# Altium schematic sheet Misaka-v1.0.SchDoc (part 2 of 2)
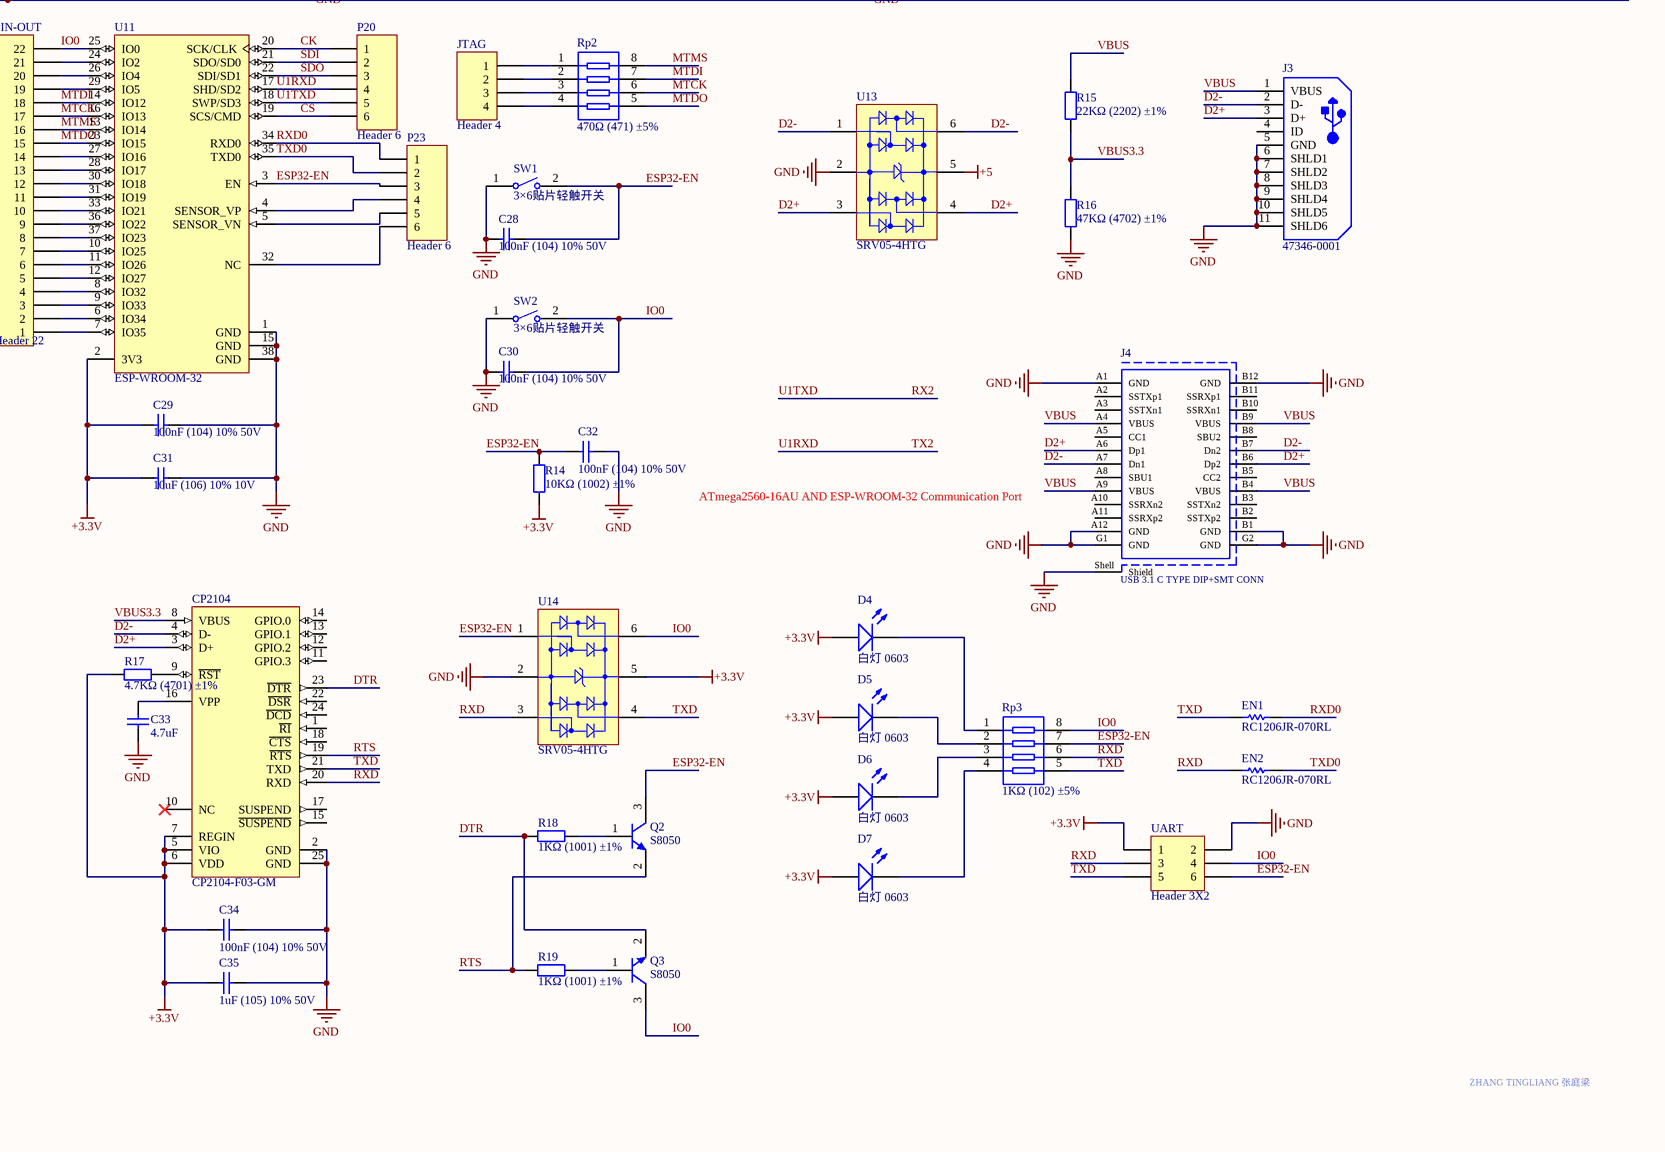
[diagram p4: Misaka-v1.0.SchDoc, bottom right]

## Library data of the parts
C1 C2 C6-C9 C11-C14 C18-C30 C32 C34 C36 C37 C-VCCREG C-VDD C-VREG C-VSREG = 0603 100nF (104) 10% 50V: 贴片电容; ComponentLink1Description: 供应商链接; ComponentLink1URL: http://www.szlcsc.com/product/details_15331.html; Package: 0603; Supplier: LC; SuppliersPartNumber: C14663
C3 C4 = CMP-2000-06216-1: Aluminum Electrolytic Capacitor, 47 uF, +/- 20%, 35 V, 2-Pin SMD (Size Code D), -55 to 105 degC, RoHS, Tape and Reel; Manufacturer: Panasonic; Lifetime@Temperature: 2000Hrs@105°C; Capacitance: 47µF; Type: Can; Rated Voltage: 35V; Ripple Current: 300mA; ESR (Equivalent Series Resistance): 0.26O; Package Reference: FP-V-D; Package Description: 2-Pin Electrolytic Aluminum Capacitor, Body 6.6 x 6.6 mm; Datasheet URL: http://industrial.panasonic.com/cdbs/www-data/pdf/RDE0000/ABA0000C1184.pdf; Series: FP; Operating Temp Range: -55to+105°C; Operating Temp-Max: 105°C; Datasheet Version: 03/2016; Manufacturer URL: http://www.panasonic.com/; Package URL: http://industrial.panasonic.com/cdbs/www-data/pdf/RDE0000/DME0000COL48.pdf; Case Size/Dimension: Ø6.3x5.8mm; Mounting Technology: SurfaceMount
C5 C10 C35 C41 C42 = 0603 1uF (105) 10% 50V: 贴片电容; ComponentLink1Description: 供应商链接; ComponentLink1URL: http://www.szlcsc.com/product/details_16531.html; Package: 0603; Supplier: LC; SuppliersPartNumber: C15849
C15-C17 = 0603 22pF (220) 5% 50V: 贴片电容; ComponentLink1Description: 供应商链接; ComponentLink1URL: http://www.szlcsc.com/product/details_2005.html; Package: 0603; Supplier: LC; SuppliersPartNumber: C1653
C31 C38 C39 = 0603 10uF (106) 10% 10V: 贴片电容; ComponentLink1Description: 供应商链接; ComponentLink1URL: http://www.szlcsc.com/product/details_20411.html; Package: 0603; Supplier: LC; SuppliersPartNumber: C19702
C33 = 0603 4.7uF (475) 10% 16V: 贴片电容; ComponentLink1Description: 供应商链接; ComponentLink1URL: http://www.szlcsc.com/product/details_20375.html; Package: 0603; Supplier: LC; SuppliersPartNumber: C19666
C40 = CMP-2000-06222-1: Aluminum Electrolytic Capacitor, 220 uF, +/- 20%, 63 V, 2-Pin SMD (Size Code H13), -55 to 105 degC, RoHS, Tape and Reel; Manufacturer: Panasonic; Impedance: 0.16ohm; Life Time @ Temperature: 2000hours@105°C; Product Range: PANASONIC-?????FK; Voltage Rating: 63V; External Length / Height: 13.5mm; Ripple Current Temperature: 105°C; Ripple Current Frequency: 100kHz; Ripple Current AC: 800mA; Power Factor: 0.08; Power Factor Frequency: 120Hz; AE Capacitor Case: RadialCan-SMD; Capacitance: 220µF; Operating Lifetime: 2000h; SVHC: NoSVHC(16-Dec-2013); Diameter: 12.5mm; Package Description: 2-Pin Electrolytic Aluminum Capacitor, Body 13.5 x 13.5 mm; Height: 13.5mm; Package URL: http://industrial.panasonic.com/cdbs/www-data/pdf/RDE0000/DME0000COL48.pdf; Lifetime @ Temperature: 2000hours@105°C; Series: FK; Mounting Technology: SurfaceMount; Datasheet Version: 03/2016; Package / Case: H13; Voltage Rating V DC: 63V; Capacitance Tolerance ±: ±20%; Tolerance +: 20%; Capacitance Tolerance: ±20%; Package Reference: FK-V-H13; Datasheet URL: https://industrial.panasonic.com/cdbs/www-data/pdf/RDE0000/ABA0000C1181.pdf; Operating Temperature Range: -55°Cto+105°C; Manufacturer URL: http://www.panasonic.com/; Operating Temperature Min: -55°C; Capacitor Terminals: SMD; Packaging: CutTape; Operating Temperature Max: 105°C; Tolerance -: 20%; Operating life Time: 2000h; Capacitor Case Style: SMD
C-BOOT C-VCC = 0603 470nF (474) 10% 25V: 贴片电容; ComponentLink1Description: 供应商链接; ComponentLink1URL: http://www.szlcsc.com/product/details_1975.html; Package: 0603; Supplier: LC; SuppliersPartNumber: C1623
C-FLY = 0603 47nF (473) 10% 50V: 贴片电容; ComponentLink1Description: 供应商链接; ComponentLink1URL: http://www.szlcsc.com/product/details_1974.html; Package: 0603; Supplier: LC; SuppliersPartNumber: C1622
C-VREGPOL = CMP-2000-06209-1: Cap Aluminum Lytic, 22 uF, +/- 20%, 6.3 to 100 V, -55 to 105 degC, 2-Pin SMD, RoHS, Tape and Reel; Manufacturer: Panasonic; Capacitance: 22µF; Rated Voltage: 50V; Lifetime@Temperature: 2000Hrs@105°C; Ripple Current: 165mA; Impedance: 0.88O; Operating Temp Range: -55to+105°C; Package Reference: EEE-FK1H220P; Case Size/Dimension: Ø6.3x5.8mm; Manufacturer URL: http://www.panasonic.com/; Datasheet URL: http://www.mouser.com/ds/2/315/ABA0000CE120-68386.pdf; Mounting Technology: SurfaceMount; Datasheet Version: 03/2014; Package Description: 2-Pin Aluminum Electrolytic Capacitor, Base 6.6 x 6.6 mm, Height 6.10 mm; Operating Temp-Max: 105°C; Series: FK; Type: Can
C-VS = 0603 220nF (224) 10% 25V: 贴片电容; ComponentLink1Description: 供应商链接; ComponentLink1URL: http://www.szlcsc.com/product/details_21832.html; Package: 0603; Supplier: LC; SuppliersPartNumber: C21120
CalibrationHeader P2 = Header 7: Header, 7-Pin; LatestRevisionDate: 17-Jul-2002; LatestRevisionNote: Re-released for DXP Platform.; Publisher: Altium Limited
Camera = MHDR2X4: Header, 4-Pin, Dual row; LatestRevisionDate: 17-Jul-2002; LatestRevisionNote: Re-released for DXP Platform.; Publisher: Altium Limited
CP2104 = CMP-0511-00004-1: Single-Chip USB to UART Bridge, 4 Dig I/O Pins, Internal Oscillator, 1024 Bytes EEPROM, -40 to 85 degC, 24-pin QFN; Manufacturer: Silicon Labs; Sub-Family: USB Bridges; Internal Oscillator: TRUE; Mounting Technology: Surface Mount; ComponentLink3URL: http://www.silabs.com/Support%20Documents/TechnicalDocs/C8051F93x-92x.pdf; DatasheetVersion: Rev. 1.0; ComponentLink1URL: http://www.silabs.com/; Code_IPC: J-STD-020; ComponentLink2URL: http://www.silabs.com/Support%20Documents/TechnicalDocs/cp2104.pdf; Code_JEDEC: MO-220; PackageReference: QFN-24; ComponentLink3Description: Package Specification; PartNumber: CP2104-F03-GM; ComponentLink1Description: Manufacturer URL; ComponentLink2Description: Datasheet; EEPROM: 1024 Bytes; PackageDescription: 24-Pin Quad-Flat No-Leads Package, Body 4 x 4 mm, Pitch 0.5 mm
D1 D8 D9 = SMA(DO-214AC) M7: 二极管; Notepad: 1N4007 4007 编号C2464 已经停售, 使用新物料编号C95872; ComponentLink1Description: 供应商链接; ComponentLink1URL: http://www.szlcsc.com/product/details_2841.html; Package: SMA(DO-214AC); Supplier: LC; SuppliersPartNumber: C95872
D2 D3 = CMP-0583-00001-2: 75 V Small Signal Switching Diode, 150 mA, 2.5 uA, 1026 Molded Package, RoHS, Tape and Reel; Manufacturer: Bourns; Reverse Voltage: 75 V; Average Forward Current: 150 mA; Reverse Current (Max.): 2.5 uA; Capacitance Between Terminals (Max.): 3 pF; Reverse Recovery Time (Max.): 4 nS; Forward Voltage (Max.): 1.00 V; Packing: Tape and Reel; Mounting Technology: Surface Mount; DatasheetVersion: Rev. 06/11; ComponentLink2URL: http://www.bourns.com/data/global/pdfs/CD1206_S01575.pdf; PackageReference: CD1206-S01575-2; RoHS: TRUE; ComponentLink1URL: http://www.bourns.com/; ComponentLink1Description: Manufacturer URL; ComponentLink3Description: Package Specification; ComponentLink3URL: http://www.bourns.com/data/global/pdfs/CD1206_S01575.pdf; ComponentLink2Description: Datasheet; PackageDescription: 2-Pin SMD, Body 3.2 x 1.5 mm; PartNumber: CD1206-S01575
D4-D7 = 0603 白灯: 发光二极管; ComponentLink1Description: 供应商链接; ComponentLink1URL: http://www.szlcsc.com/product/details_2663.html; Package: 0603; Supplier: LC; SuppliersPartNumber: C2290
EEPROM = CMP-0159-00332-1: 2Kbit, 400kHz, 2.5V, I2C Serial EEPROM, 8-Pin SOIC 150mil, Industrial Temperature; PackageReference: SOIC-SN8; Code_JEDEC: MS-012; DatasheetVersion: revJ, Feb-2009; Code_IPC: SOIC127P600-8; PackageVersion: revBB, Aug-2009; PackageDescription: 8-Lead Plastic Small Outline (SN) - Narrow, 3.90mm Body [SOIC]
EN1 EN2 GROUND-EN1 RESET-EN1 = CMP-2100-03681-1: Chip Resistor, 0 Ohm, +/- 5%, -55 to 155 degC, 1206 (3216 Metric), RoHS, Tape and Reel; Manufacturer: Yageo; Max Power Dissipation: 250mW; Resistance: 0mOhm; Voltage Rating: 200V; Temperature Coefficient: 200ppm/degreesC; Case Code (Imperial): 1206; Lead Free: LeadFree; Package Quantity: 5000; Radiation Hardening: No; Tolerance: 5%; Length: 3.1mm; Termination: SMD/SMT; Contact Plating: Tin; Military Standard: Not; Manufacturer URL: http://www.yageo.com/; Datasheet URL: http://www.yageo.com/documents/recent/PYu-RC_Group_51_RoHS_L_5.pdf; Height: 0.026inch; RoHSCompliant: true; Min Operating Temperature: -55degC; REACH SVHC: Unknown; Max Operating Temperature: 155degC; Depth: 1.6mm; Packaging: TapeandReel; Package Reference: 1206.0; Number of Terminations: 2; Case/Package: 1206; Composition: CarbonFilm; Case Code (Metric): 3216; Datasheet Version: Rev. 5, 10/2016; Power Rating: 250mW; Package Description: 2-Pin Surface Mount Device, Body 3.1 x 1.6 mm; Width: 0.063inch
F1 = CMP-2100-03653-1: PTC Resettable Fuse, 15 V, 500 mA, -40 to 85 degC, 2-Pin SMD, RoHS, Tape and Reel; Manufacturer: Bourns; Voltage Rating (DC): 15V; Max Current Rating: 100A; Power Dissipation: 800mW; Resistance: 150mOhm; Width: 3.41mm; Package Quantity: 2000; Voltage Rating: 15V; RoHSCompliant: true; Contact Plating: Gold; REACH SVHC: NoSVHC; Datasheet URL: http://www.bourns.com/docs/Product-Datasheets/mfmsmf.pdf; Lead Free: LeadFree; Height: 0.85mm; Min Operating Temperature: -40degC; Case Code (Metric): 4532; Number of Terminals: 2; Case Code (Imperial): 1812; Case/Package: 1812; Current Rating: 100A; Length: 4.73mm; Max Operating Temperature: 85degC; Package Reference: MF-MSMF050-2; Radiation Hardening: No; Datasheet Version: Rev. AG, 08/2016; Packaging: TapeandReel; Termination: SMD/SMT; Supply Voltage: 15V; Manufacturer URL: http://www.bourns.com/; Mount: SurfaceMount; Package Description: 2-Pin Surface Mount Device, Body 4.55 x 3.24 mm
FB1 = CMP-0686-00620-2: Chip Ferrite Bead for Power Lines, 30 Ohm, 4000 mA, -55 to 125 degC, 2 x 1.25 x 1.05 mm SMD, Tape and Reel; Manufacturer: Murata; DC Resistance: 0.014 Ohm Max.; Rated Current: 4000 mA; Impedance (at 100 MHz): 30 Ohm Typ.; ComponentLink3Description: Package Specification; Packing: Tape and Reel; ComponentLink3URL: http://www.murata.com/products/catalog/pdf/c31e.pdf; PackageDescription: 2-Pin Chip, Body 2 x 1.25 mm; DatasheetVersion: 08/2013; ComponentLink2Description: Datasheet; ComponentLink1Description: Manufacturer URL; PartNumber: BLM21PG300SN1D; PackageReference: BLM21_H1050-2; Mounting Technology: Surface Mount; ComponentLink1URL: http://www.murata.com/; Operating Temperature Range: -55 to 125 degC; ComponentLink2URL: http://www.murata.com/products/catalog/pdf/c31e.pdf
IC1 = CMP-0244-00311-1: Low-dropout linear regulator 5V -LM1117IMPX-5.0 / Fixed Low Drop Positive Voltage Regulator, 5V, 4-Pin SOT-223, Tape and Reel; PackageReference: SOT-223; PackageVersion: 2010; ComponentLink2URL: http://www.st.com/internet/com/TECHNICAL_RESOURCES/TECHNICAL_LITERATURE/DATASHEET/CD00000544.pdf; ComponentLink1URL: http://www.st.com; ComponentLink2Description: Datasheet; DatasheetVersion: 1/11/2011; ComponentLink1Description: Manufacturer URL; PackageDescription: 4-Pin SOT-223 Package, 6.5 x 3.5 mm Body, 2.3 mm Pitch, 7 mm Lead Span
IC2 = CMP-0095-00210-2: 8-bit AVR Microcontroller, 4.5-5.5V, 16MHz, 256KB Flash, 4KB EEPROM, 8KB SRAM, 86 GPIO pins, 100-pin TQFP, Industrial Grade (-40°C to 85°C), Pb-Free; PackageDescription: 100-Pin Thin Profile Plastic Quad Flat Pack (TQFP), 14 x 14 x 1.0 mm Body, 0.5 mm Pitch; ComponentLink1Description: Manufacturer URL; ComponentLink3URL: http://www.atmel.com/dyn/resources/prod_documents/2549S.pdf; RevisionNote: DatasheetVersion & PackageVersion updated. URLs added.; DatasheetVersion: revN, May-2011; ComponentLink2Description: ATmega640/1280/1281/2560/2561 Datasheet; PackageReference: 100A; PackageVersion: revD, Oct-2010; Code_JEDEC: MS-026-AED; ComponentLink1URL: http://www.atmel.com/; ComponentLink2URL: http://www.atmel.com/dyn/resources/prod_documents/doc2549.pdf; ComponentLink3Description: ATmega640/1280/1281/2560/2561 Summary
IC3 = CMP-0758-00080-2: Single Output Low Noise LDO, 150 mA, Fixed 3.3 V Output, 1.5% Tolerance, 2.2 to 16 V Input, Low IQ, 5-Pin SOT-23 (DBV), -40 to 125 degC, Green (RoHS & no Sb/Br), Tape and Reel; Manufacturer: Texas Instruments; Vdo (Typ) (mV): 280; Accuracy (%): 1.5; Output Options: Fixed Output; Fixed Output Options (V): 3.3; Iout (Max) (A): 0.15; Iq (Typ) (mA): 0.85; ComponentLink3Description: Package Specification; Packing: Tape and Reel; ComponentLink3URL: http://www.ti.com/litv/pdf/mpds018j; Vin (V): 2.2 to 16; Mounting Technology: Surface Mount; ComponentLink1URL: http://www.ti.com/; PartNumber: LP2985-33DBVR; PackageReference: DBV0005A; ComponentLink2URL: http://www.ti.com/lit/ds/symlink/lp2985-50.pdf; RoHS: TRUE; ComponentLink2Description: Datasheet; PackageVersion: 4073253-4/L; Operating Temperature Range (degC): -40 to 125; DatasheetVersion: SLVS522N; ComponentLink1Description: Manufacturer URL; PackageDescription: 5-Pin Plastic Small Outline, Body 2.9 x 1.6 mm, Pitch 0.95 mm
IC4 = CMP-0095-00115-3: 8-bit AVR Microcontroller, 2.7-5.5V, 16KB Flash, 512 Bytes EEPROM, 512 Bytes SRAM, 32-pin VQFN, Industrial Grade (-40°C to 85°C); ComponentLink1Description: Manufacturer URL; RevisionNote: Schematic symbol corrected; ComponentLink3URL: http://www.atmel.com/dyn/resources/prod_documents/7799S.pdf; ComponentLink2URL: http://www.atmel.com/dyn/resources/prod_documents/doc7799.pdf; PackageReference: 32PG; DatasheetVersion: revD, Nov-2010; PartNumber: ATmega16U2-MU; PackageVersion: revA, Oct-2008; Code_JEDEC: MO-220WHHD-2; PackageDescription: 32-Pin Quad Flat No-Lead (QFN) Sawn,  5 x 5 x 1.0 mm Body, Pitch 0.50 mm, 3.60mm Exposed Pad; ComponentLink2Description: ATmega8U2/16U2/32U2 Datasheet; ComponentLink1URL: http://www.atmel.com/; ComponentLink3Description: ATmega8U2/16U2/32U2 Summary
ICSP1 ICSP2 POWER TEST-HEADER TEST-HEADER1 UART = Header 3X2: Header, 3-Pin, Dual row; LatestRevisionDate: 17-Jul-2002; LatestRevisionNote: Re-released for DXP Platform.; Publisher: Altium Limited
J1 J3 = CMP-2000-05246-1: Micro-USB B Receptacle with Flange, -30 to 85 degC, 5-Pin SMD, RoHS, Tape and Reel; Manufacturer: Molex; Number of Contacts: 5; Body Orientation: RightAngle; Maximum Voltage Rating: 30VAC; Pitch: 0.65mm; Maximum Current Rating: 1.8/ContactA; Number of Ports: 1; Gender: RCP; Operating Temperature: -30to85C; Part No: 47346-0001; Color: Black; Termination Method: Solder; Contact Plating: GoldOverPalladiumNickelOverNickel; Dimension: 7.8x5.43x2.94mm; Number of Terminals: 5; Datasheet Version: Dec-13; Datasheet URL: https://datasheet.ciiva.com/30075/304740473460001-io-nectors-30075527.pdf; Contact Material: CopperAlloy; RoHS: Yes; Housing Material: LiquidCrystalPolymer; Manufacturer URL: http://www.molex.com/; Packaging: EmbossedTapeandReel; Mounting: SurfaceMount; Type: MicroUSBTypeB
J2 J4 = CMP-1502-03213-1: USB 3.1 Type C Receptacle WR-COM, Horizontal, SMT / THT; Manufacturer: Wurth Elektronik; Working Voltage: 20VDC; Rated Current: 5A; Contact Resistance: 30mOhm; Operating Temperature: -40to105degC; Publisher: WurthElektronik; Gender: Receptacle; Part Number: 632723100011; Mounting Technology: SMT/THT; Datasheet URL: https://katalog.we-online.de/em/datasheet/632723x00011%282%29.pdf; Connector Type: USB3.1TypeC; Manufacturer URL: https://item.szlcsc.com/292999.html; Orientation: Horizontal; Package Reference: 632723100011; Packaging: TapeandReel
JTAG P7 P12 P13 = Header 4: Header, 4-Pin; LatestRevisionDate: 17-Jul-2002; LatestRevisionNote: Re-released for DXP Platform.; Publisher: Altium Limited
L1 = 0603 10uH 10%: 贴片电感; ComponentLink1Description: 供应商链接; ComponentLink1URL: http://www.szlcsc.com/product/details_1387.html; Package: 0603; Supplier: LC; SuppliersPartNumber: C1035
L2 RX1 TX1 = 0603 黄灯: 发光二极管; ComponentLink1Description: 供应商链接; ComponentLink1URL: http://www.szlcsc.com/product/details_73147.html; Package: 0603; Supplier: LC; SuppliersPartNumber: C72038
M1 M2 = CMP-2100-03693-1: Toshiba Bi-CD Integrated Circuit Silicon Monolithicr, 2.7 to 5.5 V, 1 A, -20 to 85 degC, 24-Pin SSOP, RoHS, Tape and Reel; Package Reference: SSOP24-P-300-0.65A; Manufacturer URL: http://www.toshiba.com/; Datasheet URL: https://toshiba.semicon-storage.com/info/docget.jsp?did=10660&prodName=TB6612FNG; Manufacturer: Toshiba; Package Description: 24-Pin Shrink Small Outline Package Integrated Circuit, Body 7.8 x 5.6 mm, Pitch 0.65 mm; Datasheet Version: 41913.0
ON1 = 0805 翠绿: 发光二极管; ComponentLink1Description: 供应商链接; ComponentLink1URL: http://www.szlcsc.com/product/details_2670.html; Package: 0805; Supplier: LC; SuppliersPartNumber: C2297
P1 = Header 3: Header, 3-Pin; LatestRevisionDate: 17-Jul-2002; LatestRevisionNote: Re-released for DXP Platform.; Publisher: Altium Limited
P3 = CMP-2000-05163-1: Male Header, Pitch 2 mm, 1 x 2 Position, Height 6.6 mm, RoHS, Tape and Reel; Manufacturer: JST; No of Positions: 2; Style/Orientation: StraightHeader/Plug; Pitch: 2mm; Datasheet URL: https://ciiva.com/datasheet-click-26894756?src=ciiva&sig=90099765; Termination: Crimp; Manufacturer URL: http://www.jst.com/home2.html; Type: ShroudedHeader; Datasheet Version: Dec-12
P4 = CMP-2000-05163-1: Male Header, Pitch 2 mm, 1 x 2 Position, Height 6.6 mm, RoHS, Tape and Reel / B2B-PH-SM4-TB(LF)(SN); Manufacturer: JST; No of Positions: 2; Style/Orientation: StraightHeader/Plug; Pitch: 2mm; Datasheet URL: https://ciiva.com/datasheet-click-26894756?src=ciiva&sig=90099765; Termination: Crimp; Manufacturer URL: http://www.jst.com/home2.html; Type: ShroudedHeader; Datasheet Version: Dec-12
P5 = CMP-2000-07027-1: Male Header, Pitch 2 mm, 1 x 6 Position, Height 5.5 mm, -25 to 85 degC / S6B-PH-SM4-TB(LF)(SN); Manufacturer: JST; Pitch: 2mm; Style/Orientation: RightAngleHeader/Plug; No of Positions: 6; Package Reference: S6B-PH-SM4-TB(LF)(SN); Type: ShroudedHeader; Package Description: Male Header, Pitch 2 mm, 1 x 6 Position, Height 5.5 mm; Mounting Technology: SurfaceMount; Datasheet Version: 11/2008; Termination: Solder; Datasheet URL: https://datasheet.ciiva.com/11747/0900766b80df0d9d-11747278.pdf; Manufacturer URL: http://www.jst.com/home2.html
P6 = CMP-2000-07078-1: Male Header, Pitch 2 mm, 1 x 4 Position, Height 5.7 mm, -25 to 85 degC, RoHS, Tape and Reel; Manufacturer: Japan Solderless Terminals; Pitch: 2mm; No of Positions: 4; Style/Orientation: RightAngleHeader/Plug; Termination: Crimp; Datasheet URL: http://www.jst-mfg.com/product/pdf/eng/ePA-F.pdf; Datasheet Version: 03/2012; Mounting Technology: SurfaceMount; Package Reference: SM04B-PASS-TBT(LF)(SN); Manufacturer URL: http://www.jst-mfg.com/index_e.php; Type: WiretoBoard; Package Description: Male Header, Pitch 2 mm, 1 x 4 Position, Height 5.7 mm
P8-P11 = CMP-1755-00001-1: Male Header, Pitch 2 mm, 1 x 2 Position, Height 5.5 mm, -25 to 85 degC, RoHS, Tape and Reel; Current Rating: 3 A; ComponentLink1URL: http://www.jst.com/home2.html; Radiation Hardening: No; RoHSCompliant: True; Mount: Through Hole; Contact Material: Bronze; Package Quantity: 100; Width: 2.34 mm; DatasheetVersion: Dec-12; Height: 8.13 mm; Max Operating Temperature: 105degC; ComponentLink2Description: Datasheet; Lead Pitch: 0.1 inch; Contact Finish: Lead; Packaging: Bulk; Colour: Black; Contact Plating: Tin; Min Operating Temperature: -65degC; ComponentLink1Description: Manufacturer URL; PackageReference: S2B-PH-SM4-TB(LF)(SN)-2; PackageDescription: Male Header, Pitch 2 mm, 1 x 2 Position, Height 5.5 mm; ComponentLink2URL: http://www.jst-mfg.com/product/pdf/eng/ePH.pdf; Pins: 40; Length: 101.19 mm
P14 P16 P17 P19 P21 P22 = Header 8: Header, 8-Pin; LatestRevisionDate: 17-Jul-2002; LatestRevisionNote: Re-released for DXP Platform.; Publisher: Altium Limited
P15 P18 = Header 17: Header, 17-Pin; LatestRevisionDate: 17-Jul-2002; LatestRevisionNote: Re-released for DXP Platform.; Publisher: Altium Limited
P20 P23 P24 = Header 6: Header, 6-Pin; LatestRevisionDate: 17-Jul-2002; LatestRevisionNote: Re-released for DXP Platform.; Publisher: Altium Limited
PIN-OUT = Header 22: Header, 22-Pin; LatestRevisionDate: 17-Jul-2002; LatestRevisionNote: Re-released for DXP Platform.; Publisher: Altium Limited
Q1 = AO3401A P道沟 X13A15 SOT-23: MOS(场效应管); ComponentLink1Description: 供应商链接; ComponentLink1URL: http://www.szlcsc.com/product/details_15801.html; Package: SOT-23; Supplier: LC; SuppliersPartNumber: C15127
Q2 Q3 = CMP-1048-00631-1: General Purpose Transistor, NPN Silicon, 3-Pin SOT-23, Pb-Free, Tape and Reel / MMBT3904LT1G; Manufacturer: On Semiconductor; IC Continuous (A): 0.2; fT Min (MHz): 300; ComponentLink2Description: Datasheet; Polarity: NPN; PackageDescription: 3-Pin Small Outline Transistor, Body 2.92 x 1.3 mm, Pitch 0.95 mm; ComponentLink2URL: http://www.onsemi.cn/pub_link/Collateral/MMBT3904LT1-D.PDF; DatasheetVersion: Rev. 12; Mounting Technology: Surface Mount; PartNumber: MMBT3904LT1G; ComponentLink1URL: http://www.onsemi.com/; ComponentLink3Description: Package Specification; ComponentLink1Description: Manufacturer URL; PackageVersion: Rev. AP, 11/2009; PackageReference: SOT-23-3-318-08; Packing: Tape and Reel; ComponentLink3URL: http://www.onsemi.cn/pub_link/Collateral/318-08.PDF; RoHS: TRUE
R1 R2 = 0603 22Ω (22R0) 1%: 贴片电阻; ComponentLink1Description: 供应商链接; ComponentLink1URL: http://www.szlcsc.com/product/details_24078.html; Package: 0603; Supplier: LC; SuppliersPartNumber: C23345
R3 R6 R13 R18 R19 R23 = 0603 1KΩ (1001) 1%: 贴片电阻; ComponentLink1Description: 供应商链接; ComponentLink1URL: http://www.szlcsc.com/product/details_21904.html; Package: 0603; Supplier: LC; SuppliersPartNumber: C21190
R4 R5 R7 R8 R10 R11 R14 = 0603 10KΩ (1002) 1%: 贴片电阻; ComponentLink1Description: 供应商链接; ComponentLink1URL: http://www.szlcsc.com/product/details_26547.html; Package: 0603; Supplier: LC; SuppliersPartNumber: C25804
R9 R12 = 0603 1MΩ (1004) 1%: 贴片电阻; ComponentLink1Description: 供应商链接; ComponentLink1URL: http://www.szlcsc.com/product/details_23662.html; Package: 0603; Supplier: LC; SuppliersPartNumber: C22935
R15 = 0603 22KΩ (2202) 1%: 贴片电阻; ComponentLink1Description: 供应商链接; ComponentLink1URL: http://www.szlcsc.com/product/details_32812.html; Package: 0603; Supplier: LC; SuppliersPartNumber: C31850
R16 = 0603 47KΩ (4702) 1%: 贴片电阻; ComponentLink1Description: 供应商链接; ComponentLink1URL: http://www.szlcsc.com/product/details_26562.html; Package: 0603; Supplier: LC; SuppliersPartNumber: C25819
R17 R22 R24-R26 = 0603 4.7KΩ (4701) 1%: 贴片电阻; ComponentLink1Description: 供应商链接; ComponentLink1URL: http://www.szlcsc.com/product/details_23889.html; Package: 0603; Supplier: LC; SuppliersPartNumber: C23162
R20 R21 = 0603 39KΩ (3902) 1%: 贴片电阻; ComponentLink1Description: 供应商链接; ComponentLink1URL: http://www.szlcsc.com/product/details_23880.html; Package: 0603; Supplier: LC; SuppliersPartNumber: C23153
RA = 0603 15KΩ (1502) 1%: 贴片电阻; ComponentLink1Description: 供应商链接; ComponentLink1URL: http://www.szlcsc.com/product/details_23536.html; Package: 0603; Supplier: LC; SuppliersPartNumber: C22809
RB = 0603 100KΩ (1003) 1%: 贴片电阻; ComponentLink1Description: 供应商链接; ComponentLink1URL: http://www.szlcsc.com/product/details_26546.html; Package: 0603; Supplier: LC; SuppliersPartNumber: C25803
RESET1 = CMP-1452-00002-1: WS-TASV SMD Tact Switch 6X6 mm; Manufacturer: Wuerth Elektronik; NoPins: 04; PartNumber: 430152043836; ComponentLink2URL: http://katalog.we-online.de/em/datasheet/4301x2.pdf; ComponentLink1URL: http://www.we-online.com; ComponentLink2Description: Datasheet; ComponentLink1Description: Manufacturer URL; PackageReference: 430152043836
Rp1 Rp3 = 0603*4  1KΩ (102) 5%: 贴片排阻; ComponentLink1Description: 供应商链接; ComponentLink1URL: http://www.szlcsc.com/product/details_20907.html; Package: 0603*4; Supplier: LC; SuppliersPartNumber: C20197
Rp2 = 0603*4 470Ω (471) 5%: 贴片排阻; ComponentLink1Description: 供应商链接; ComponentLink1URL: http://www.szlcsc.com/product/details_26253.html; Package: 0603*4; Supplier: LC; SuppliersPartNumber: C25510
SW1-SW3 = CMP-2000-07511-1: FSMSM Push Button Switch, 50 mA, -35 to 85 degC, 2-Pin SMD, RoHS, Bulk; Manufacturer: TE Connectivity; Actuator Length: 1.07mm; Electrical Life: 20000Cycles; Actuator Material: Polyamide; Current Rating: 50mA; Illumination Type: Illuminated; Voltage Rating (DC): 24V; Contact Resistance: 100mOhm; Case\/Package: SMD/SMT; Operating Force: 180gf; Switch Travel: 0.25mm; Max Voltage Rating (DC): 12V; Throw Configuration: SPST; Packaging: LoosePiece; Max Operating Temperature: 85degC; ELV: Compliant; Package Description: 2-Pin Surface Mount Device, Body 6 x 3.5 mm, Pitch 9.19 mm; RoHSCompliant: true; Manufacturer URL: http://www.te.com/; Contact Plating: Silver; Contact Material: Brass; Mounting Technology: SurfaceMount; Contact Current Rating: 50mA; Datasheet Version: Rev. C2, 08/2014; Datasheet URL: http://www.te.com/commerce/DocumentDelivery/DDEController?Action=showdoc&DocId=Customer+Drawing%7F1437566-3%7FC2%7Fpdf%7FEnglish%7FENG_CD_1437566-3_C2_1437566_3_1_c.dwg.pdf%7F1437566-3; Mechanical Life: 20000Cycles; Package Reference: FSMSM; REACH SVHC: Unknown; Orientation: Straight; Min Operating Temperature: -35degC; Lead Free: LeadFree; Termination: GullWing; Package Quantity: 1000; Mount: SurfaceMount
U1 = LM358DR2G_[C7950]: 通用运放; ComponentLink1Description: 供应商链接; ComponentLink1URL: http://www.szlcsc.com/product/details_8427.html; Package: SOIC-8; Supplier: LC; SuppliersPartNumber: C7950
U2-U10 = CMP-2000-05026-1: Intelligent Control LED Integrated Light Source, 3.5 to 5.3 V, -25 to 80 degC, 4-Pin SMD, RoHS, Tape and Reel / 1655; Manufacturer: Adafruit-Industries-LLC; Number of LEDs: 10; Configuration: Discrete; Utilized LED: WS2812(5050); Datasheet URL: http://datasheet.octopart.com/ADA1655-Adafruit-Industries-datasheet-32028139.pdf; Series: Neopixel; Interface: -; Package Description: 4-Pin Surface Mount Device, Body 5 x 5 mm; Color: Red,Green,Blue(RGB); Category: Optoelectronics; Controller Type: -; Package Reference: 1655; Manufacturer URL: https://www.adafruit.com/; Mounting Type: SurfaceMount; Datasheet Version: May-13; Size / Dimension: 5.00mmLx5.00mmW; Family: Addressable,Specialty
U11 = CMP-2000-07454-1: Espressif System, 2.7 to 3.6 V, -40 to 85 degC, 38-Pin SMD; Manufacturer: Olimex; Package Description: 38-Pin Surface Mount Device, Body 18 x 25.5 mm, Pitch 1.27 mm; Manufacturer URL: https://www.olimex.com; RoHSCompliant: false; Mounting Technology: SurfaceMount; Datasheet Version: Rev. 2.1, 09/2017; Datasheet URL: http://www.espressif.com/sites/default/files/documentation/esp-wroom-32_datasheet_en.pdf; Package Reference: ESP-WROOM-32
U12 = CMP-0009-00001-1: XBee ZB SMT RF Module, 2.4 GHz, 250 kbps, -100 dBm, 2.1 to 3.6 V, 28 mA, 3.1 mW, -40 to 85 degC, 37-Pin Module, RoHS; Manufacturer: Digi international; Operating Current (Receive): 28 mA; Transmit Power Output: 3.1 mW; Indoor/Urban Range: Up to 200 ft. (60 m); RF Data Rate: 250000 bps; Operating Frequency Band: ISM 2.4 to 2.5 GHz; Outdoor RF line-of-sight Range: Up to 4000 ft. (1200 m); Operating Temperature: -40 to 85 degC; Supply Voltage: 2.1 to 3.6 V; ComponentLink3URL: http://ftp1.digi.com/support/documentation/90002002_K.pdf; ROHS: TRUE; PackageDescription: 37-Pin Module, Body 21.996 x 33.782 mm, Pitch 2.007 mm; PackageReference: XB24CZ7RIS-004-Module-37; DatasheetVersion: Sep-13; ComponentLink3Description: Package Specification; Receiver Sensitivity: -100 dBm; ComponentLink2URL: http://ftp1.digi.com/support/documentation/90002002_K.pdf; PartNumber: XB24CZ7RIS-004; Mounting Technology: Surface Mount; ComponentLink1Description: Manufacturer URL; ComponentLink2Description: Datasheet; PackageVersion: 6/9/2013; ComponentLink1URL: http://www.digi.com/
U13 U14 = CMP-2000-05192-1: Diode Array, 6 V, 10 A, -40 to 125 degC, 6-Pin SOT-23, RoHS, Tape and Reel; Polarity: Bidirectional; Brand: Littelfuse; Clamping Voltage: 15V; Peak Surge Current: 10A; Working Voltage: 6V; Pd - Power Dissipation: 150W; Number of Channels: 4Channel; Mounting Style: SMD/SMT; Termination Style: SMD/SMT; Datasheet Version: May-15; Height: 1.45mm; Manufacturer: Littelfuse; Manufacturer URL: http://www.littelfuse.com/; Package URL: http://www.vishay.com/docs/28729/28729.pdf; RoHS: True; Package Reference: SOT23-6; Type: TVSDiodeArraysLowCapacitanceESDProtection; Product Category: TVSDiodeArrays; Datasheet URL: http://www.littelfuse.com/~/media/electronics/datasheets/tvs_diode_arrays/littelfuse_tvs_diode_array_srv05_datasheet.pdf.pdf; Package / Case: SOT-23-6; Minimum Operating Temperature: -40C; Maximum Operating Temperature: +85C; Width: 3mm; Package Description: 6-Pin Small Outline Transistor, Body 2.9 x 1.625 mm, Pitch 0.95 mm; Length: 3mm; Series: SRV05; Packaging: Reel
U15 = CMP-1005-00005-1: System-In-Package Integrating Microstepping Controller and 10 A Power MOSFET, 7.5 to 85 V, -40 to 150 degC, 102-Pin QFN (VFQFN), RoHS, Tray; Manufacturer: STMicroelectronics; Iboot: 2.6 mA Typ.; RpumpHS: 10 Ohm Typ.; RDS(on)@125 degC: 23 MOhm Typ.; RoHS: TRUE; ComponentLink2Description: Datasheet; Temperature Range: -40 to 150 degC; Packing: Tray; Operating Voltage: 7.5 to 85 V; ComponentLink2URL: http://www.st.com/st-web-ui/static/active/en/resource/technical/document/datasheet/DM00090983.pdf; Mounting Technology: Surface Mount; ComponentLink3Description: Package Specification; PartNumber: POWERSTEP01; PackageDescription: 102-Pin Quad Flat Non-Leaded Package, Body 11 x 14 mm; ComponentLink3URL: http://www.st.com/st-web-ui/static/active/en/resource/technical/document/datasheet/DM00090983.pdf; ComponentLink1Description: Manufacturer URL; DatasheetVersion: Rev. 4; ComponentLink1URL: www.st.com
X1 = Header 2: Header, 2-Pin; LatestRevisionDate: 17-Jul-2002; LatestRevisionNote: Re-released for DXP Platform.; Publisher: Altium Limited
Y1 = SMD-3225_4P  16MHZ 9PF 10PPM: 贴片晶振; ComponentLink1Description: 供应商链接; ComponentLink1URL: http://www.szlcsc.com/product/details_14393.html; Package: SMD-3225_4P; Supplier: LC; SuppliersPartNumber: C13738
Y2 = CMP-0588-00001-2: Ceramic Resonator, 16 MHz with Built-in Capacitance, Thickness Expander Mode, Initial Frequency Tolerance +/- 0.5%, Load Capacity 15 pF, -20 to 80 degC, 3.2 x 1.3 x 1 mm SMD, RoHS, Reel; Manufacturer: Murata; Oscillating Frequency: 16 MHz; Load Capacity: 15 pF; PackageDescription: 3-Pin SMD, Body 3.2 x 1.3 mm, Pitch 0.95 mm; Mounting Technology: Surface Mount; ComponentLink1URL: http://www.murata.com/; RoHS: TRUE; Packing: Reel; Initial Frequency Tolerance: +/- 0.5%; PartNumber: CSTCE16M0V53-R0; ComponentLink2Description: Datasheet; DatasheetVersion: Rev. P16E-22; PackageReference: CSTCE_V-3; Operating Temperature Range: -20 to 80 degC; ComponentLink2URL: http://www.murata.com/products/catalog/pdf/p16e.pdf; ComponentLink1Description: Manufacturer URL; Initial Tolerance: +/- 0.5%
Z1 Z2 = CMP-0584-00001-2: ESD Protector, 5 V Supply, -40 to 85 degC, 1.6 x 0.8 x 0.55 mm SMD, RoHS, Tape and Reel; Manufacturer: Bourns; VC: 20 V; VT: 150 V; RT: 1 ns; VDC: 5 V; CO: 0.5 pF; PartNumber: CG0603MLC-05E; ComponentLink1Description: Manufacturer URL; ComponentLink1URL: http://www.bourns.com/; Packing: Tape and Reel; Mounting Technology: Surface Mount; ComponentLink2Description: Datasheet; RoHS: TRUE; Operating Temperature: -40 to 85 degC; DatasheetVersion: Rev. S; PackageDescription: 2-Pin SMD, Body 1.6 x 0.8 mm, Pitch 1.52 mm; PackageReference: CG0603-2; ComponentLink2URL: http://www.bourns.com/data/global/pdfs/MLC.pdf